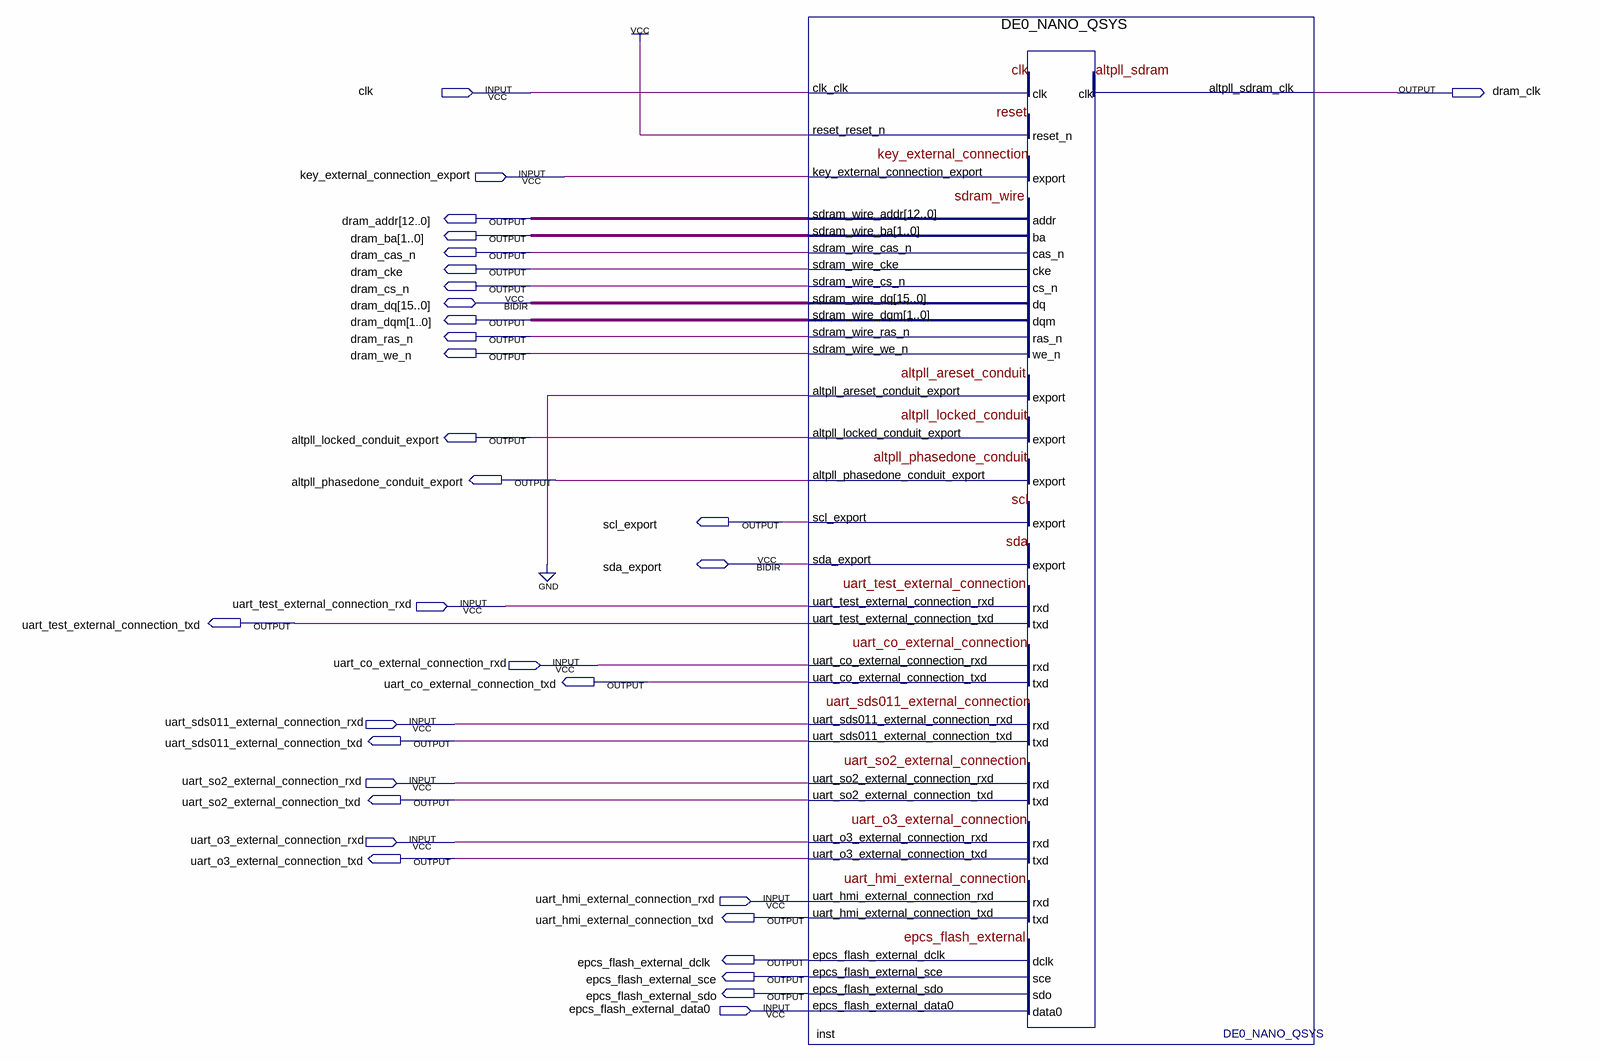
[diagram p0: schematic sheet]
// Quartus schematic test1.bdf as structural Verilog: 1 symbols, 32 pins
module test1 (
  input  clk,
  input  key_external_connection_export,
  input  uart_test_external_connection_rxd,
  input  uart_co_external_connection_rxd,
  input  uart_sds011_external_connection_rxd,
  input  uart_so2_external_connection_rxd,
  input  uart_o3_external_connection_rxd,
  input  uart_hmi_external_connection_rxd,
  input  epcs_flash_external_data0,
  inout  [15:0] dram_dq,
  inout  sda_export,
  output dram_clk,
  output [12:0] dram_addr,
  output [1:0] dram_ba,
  output dram_cas_n,
  output dram_cke,
  output dram_cs_n,
  output [1:0] dram_dqm,
  output dram_ras_n,
  output dram_we_n,
  output altpll_locked_conduit_export,
  output altpll_phasedone_conduit_export,
  output scl_export,
  output uart_test_external_connection_txd,
  output uart_co_external_connection_txd,
  output uart_sds011_external_connection_txd,
  output uart_so2_external_connection_txd,
  output uart_o3_external_connection_txd,
  output uart_hmi_external_connection_txd,
  output epcs_flash_external_dclk,
  output epcs_flash_external_sce,
  output epcs_flash_external_sdo
);

  DE0_NANO_QSYS inst (
    .clk_clk(clk), .reset_reset_n(1'b1), .key_external_connection_export(key_external_connection_export),
    .altpll_areset_conduit_export(1'b0),
    .uart_test_external_connection_rxd(uart_test_external_connection_rxd),
    .uart_co_external_connection_rxd(uart_co_external_connection_rxd),
    .uart_sds011_external_connection_rxd(uart_sds011_external_connection_rxd),
    .uart_so2_external_connection_rxd(uart_so2_external_connection_rxd),
    .uart_o3_external_connection_rxd(uart_o3_external_connection_rxd),
    .uart_hmi_external_connection_rxd(uart_hmi_external_connection_rxd),
    .epcs_flash_external_data0(epcs_flash_external_data0), .sdram_wire_addr(dram_addr),
    .sdram_wire_ba(dram_ba), .sdram_wire_cas_n(dram_cas_n), .sdram_wire_cke(dram_cke),
    .sdram_wire_cs_n(dram_cs_n), .sdram_wire_dqm(dram_dqm), .sdram_wire_ras_n(dram_ras_n),
    .sdram_wire_we_n(dram_we_n), .altpll_sdram_clk(dram_clk),
    .altpll_locked_conduit_export(altpll_locked_conduit_export),
    .altpll_phasedone_conduit_export(altpll_phasedone_conduit_export), .scl_export(scl_export),
    .uart_test_external_connection_txd(uart_test_external_connection_txd),
    .uart_co_external_connection_txd(uart_co_external_connection_txd),
    .uart_sds011_external_connection_txd(uart_sds011_external_connection_txd),
    .uart_so2_external_connection_txd(uart_so2_external_connection_txd),
    .uart_o3_external_connection_txd(uart_o3_external_connection_txd),
    .uart_hmi_external_connection_txd(uart_hmi_external_connection_txd),
    .epcs_flash_external_dclk(epcs_flash_external_dclk), .epcs_flash_external_sce(epcs_flash_external_sce),
    .epcs_flash_external_sdo(epcs_flash_external_sdo), .sdram_wire_dq(dram_dq), .sda_export(sda_export));
endmodule
